# Altium schematic sheet SJA1105Q_PINOUT.SchDoc
size D; SheetNumber: 2; SheetTotal: 7
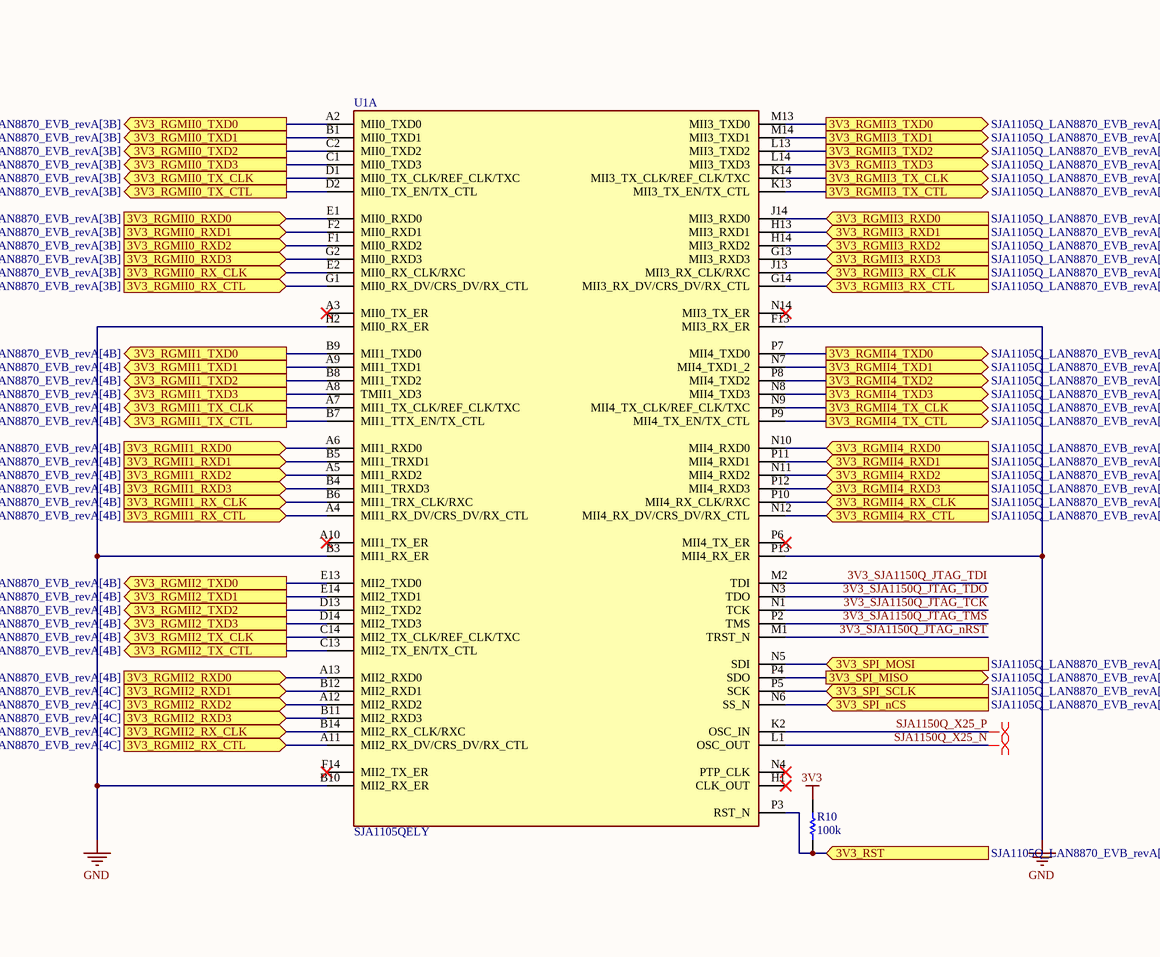
[diagram p0: SJA1105Q_PINOUT.SchDoc, top left]
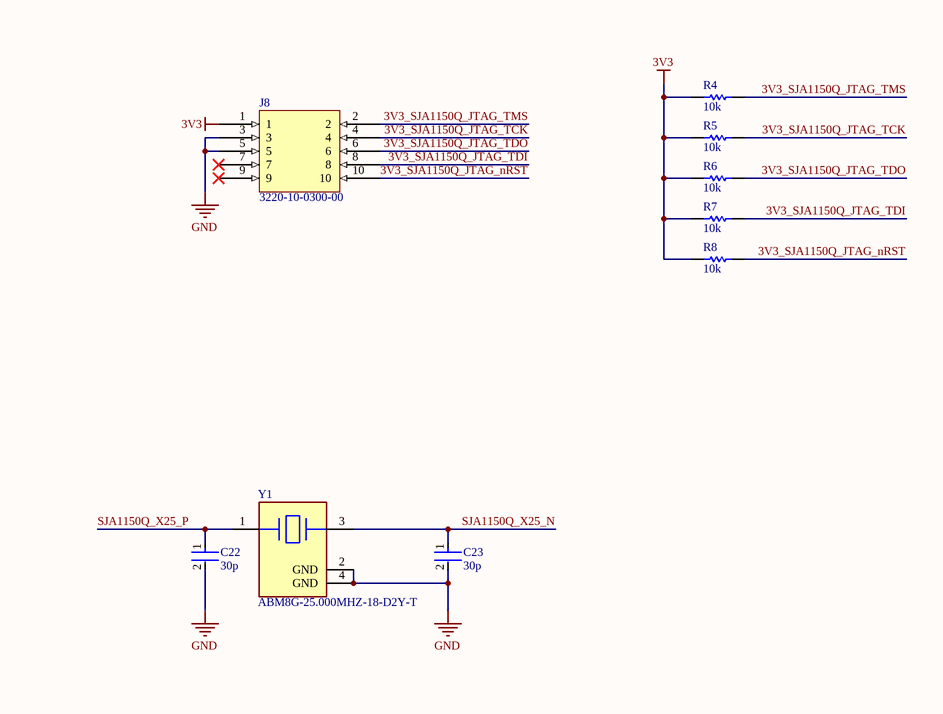
[diagram p1: SJA1105Q_PINOUT.SchDoc, top right]
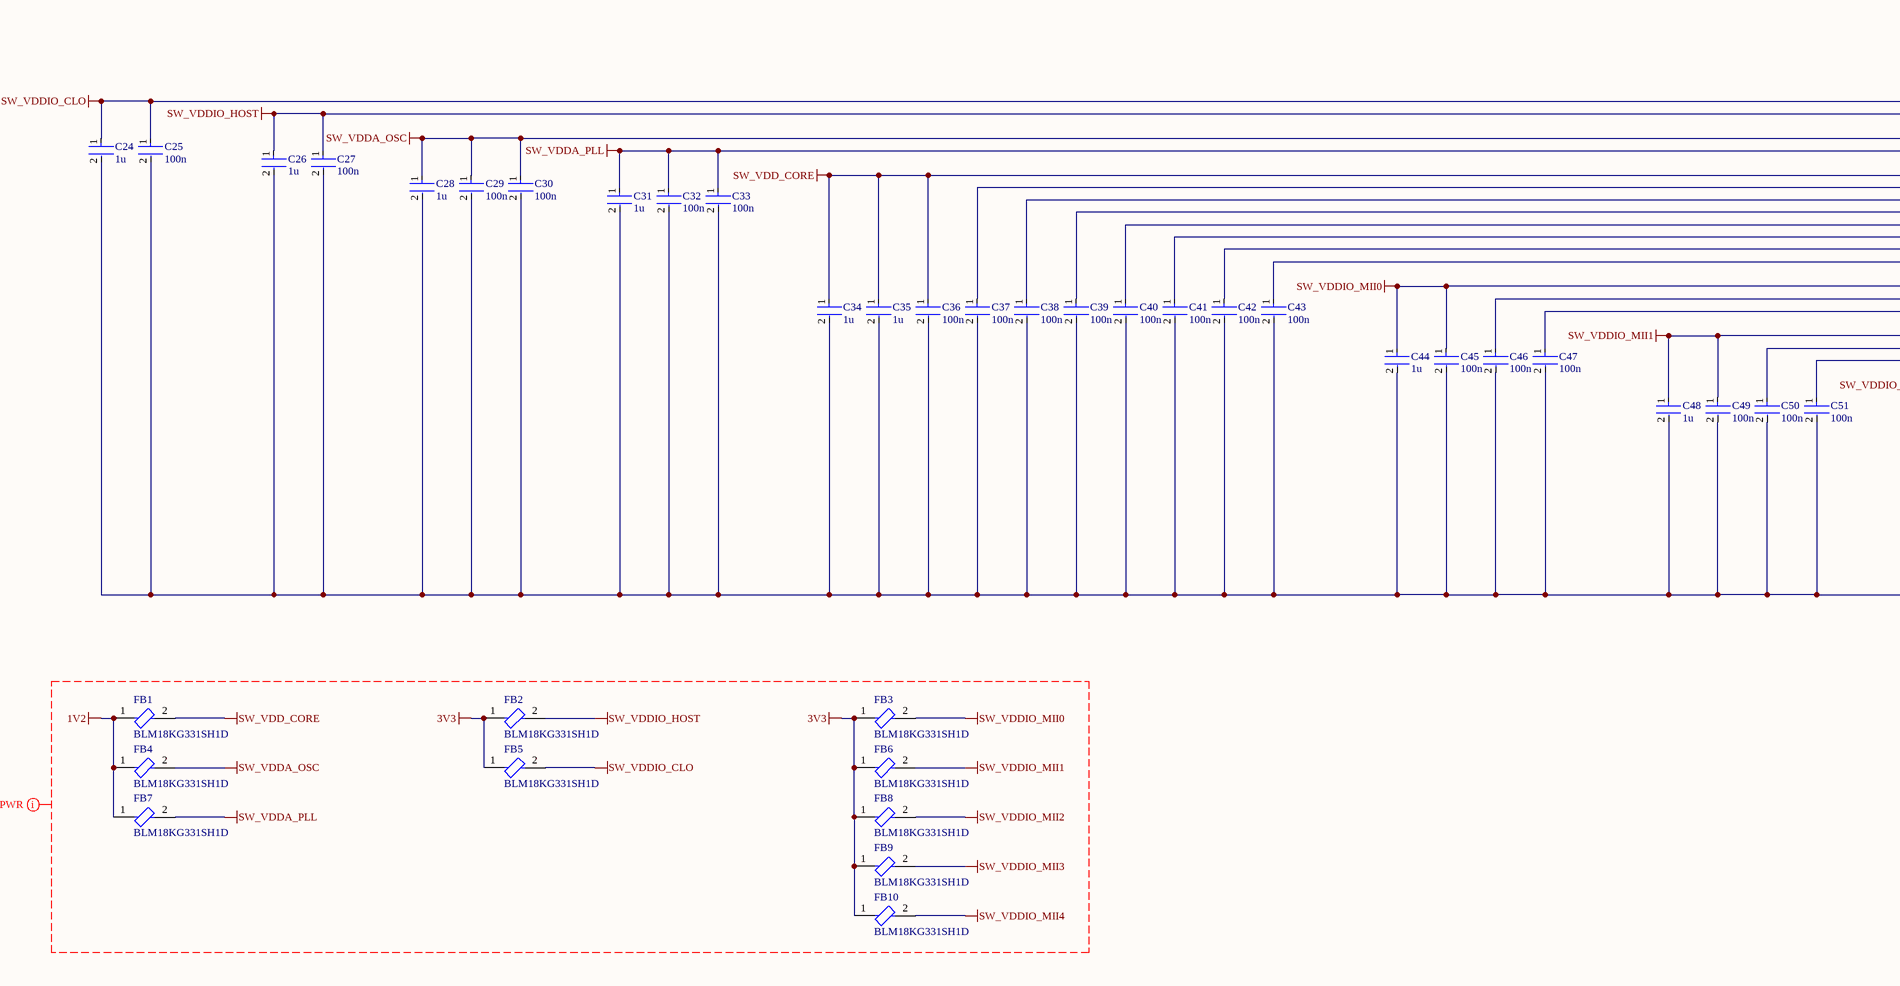
[diagram p2: SJA1105Q_PINOUT.SchDoc, bottom left]
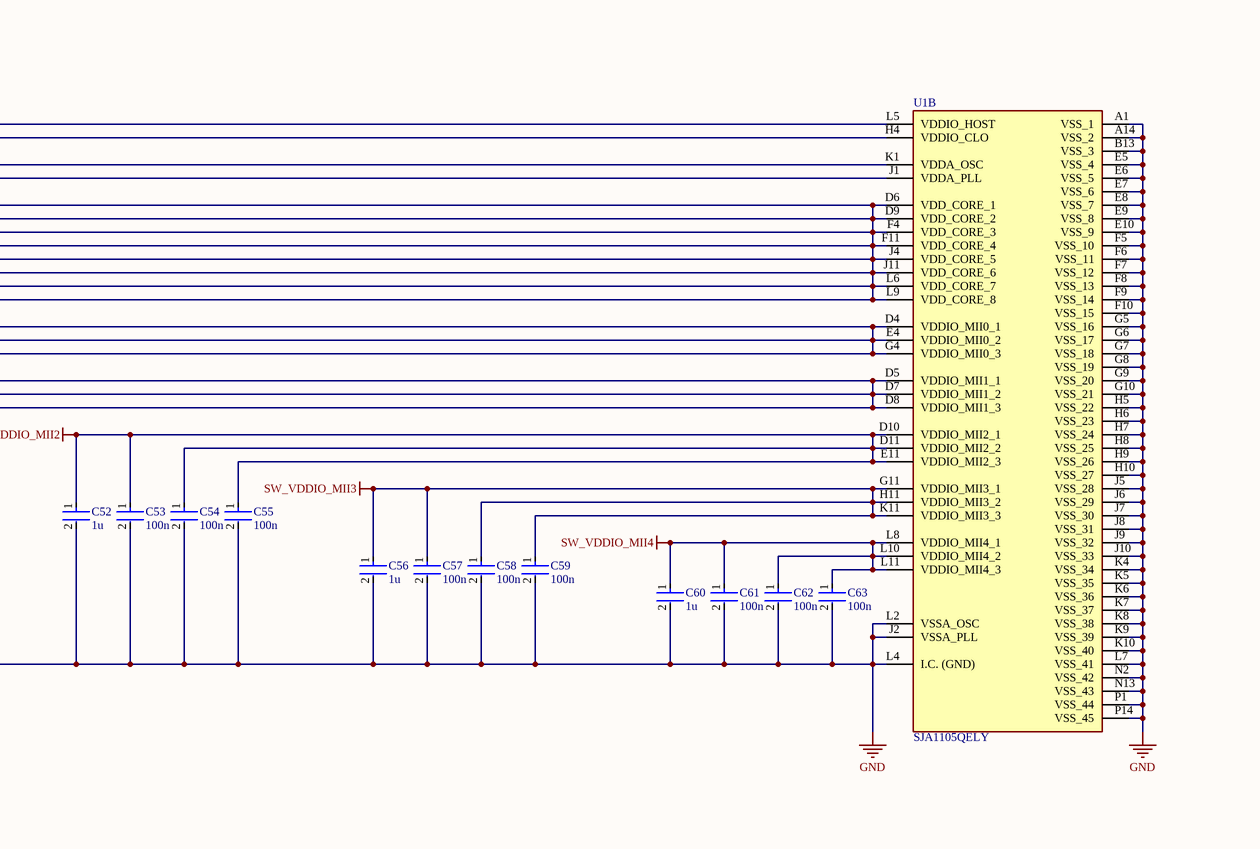
[diagram p3: SJA1105Q_PINOUT.SchDoc, bottom right]

## Parts
C22  30p  [FP-0402-L_1_0_0_05-W_0_5-IPC_A]
C23  30p  [FP-0402-L_1_0_0_05-W_0_5-IPC_A]
C24  1u  [FP-0402-L_1_0_0_05-W_0_5-IPC_A]
C25  100n  [FP-0402-L_1_0_0_05-W_0_5-IPC_A]
C26  1u  [FP-0402-L_1_0_0_05-W_0_5-IPC_A]
C27  100n  [FP-0402-L_1_0_0_05-W_0_5-IPC_A]
C28  1u  [FP-0402-L_1_0_0_05-W_0_5-IPC_A]
C29  100n  [FP-0402-L_1_0_0_05-W_0_5-IPC_A]
C30  100n  [FP-0402-L_1_0_0_05-W_0_5-IPC_A]
C31  1u  [FP-0402-L_1_0_0_05-W_0_5-IPC_A]
C32  100n  [FP-0402-L_1_0_0_05-W_0_5-IPC_A]
C33  100n  [FP-0402-L_1_0_0_05-W_0_5-IPC_A]
C34  1u  [FP-0402-L_1_0_0_05-W_0_5-IPC_A]
C35  1u  [FP-0402-L_1_0_0_05-W_0_5-IPC_A]
C36  100n  [FP-0402-L_1_0_0_05-W_0_5-IPC_A]
C37  100n  [FP-0402-L_1_0_0_05-W_0_5-IPC_A]
C38  100n  [FP-0402-L_1_0_0_05-W_0_5-IPC_A]
C39  100n  [FP-0402-L_1_0_0_05-W_0_5-IPC_A]
C40  100n  [FP-0402-L_1_0_0_05-W_0_5-IPC_A]
C41  100n  [FP-0402-L_1_0_0_05-W_0_5-IPC_A]
C42  100n  [FP-0402-L_1_0_0_05-W_0_5-IPC_A]
C43  100n  [FP-0402-L_1_0_0_05-W_0_5-IPC_A]
C44  1u  [FP-0402-L_1_0_0_05-W_0_5-IPC_A]
C45  100n  [FP-0402-L_1_0_0_05-W_0_5-IPC_A]
C46  100n  [FP-0402-L_1_0_0_05-W_0_5-IPC_A]
C47  100n  [FP-0402-L_1_0_0_05-W_0_5-IPC_A]
C48  1u  [FP-0402-L_1_0_0_05-W_0_5-IPC_A]
C49  100n  [FP-0402-L_1_0_0_05-W_0_5-IPC_A]
C50  100n  [FP-0402-L_1_0_0_05-W_0_5-IPC_A]
C51  100n  [FP-0402-L_1_0_0_05-W_0_5-IPC_A]
C52  1u  [FP-0402-L_1_0_0_05-W_0_5-IPC_A]
C53  100n  [FP-0402-L_1_0_0_05-W_0_5-IPC_A]
C54  100n  [FP-0402-L_1_0_0_05-W_0_5-IPC_A]
C55  100n  [FP-0402-L_1_0_0_05-W_0_5-IPC_A]
C56  1u  [FP-0402-L_1_0_0_05-W_0_5-IPC_A]
C57  100n  [FP-0402-L_1_0_0_05-W_0_5-IPC_A]
C58  100n  [FP-0402-L_1_0_0_05-W_0_5-IPC_A]
C59  100n  [FP-0402-L_1_0_0_05-W_0_5-IPC_A]
C60  1u  [FP-0402-L_1_0_0_05-W_0_5-IPC_A]
C61  100n  [FP-0402-L_1_0_0_05-W_0_5-IPC_A]
C62  100n  [FP-0402-L_1_0_0_05-W_0_5-IPC_A]
C63  100n  [FP-0402-L_1_0_0_05-W_0_5-IPC_A]
FB1  BLM18KG331SH1D  [FP-BLM18-0_15-t0_8-IPC_B]
FB2  BLM18KG331SH1D  [FP-BLM18-0_15-t0_8-IPC_B]
FB3  BLM18KG331SH1D  [FP-BLM18-0_15-t0_8-IPC_B]
FB4  BLM18KG331SH1D  [FP-BLM18-0_15-t0_8-IPC_B]
FB5  BLM18KG331SH1D  [FP-BLM18-0_15-t0_8-IPC_B]
FB6  BLM18KG331SH1D  [FP-BLM18-0_15-t0_8-IPC_B]
FB7  BLM18KG331SH1D  [FP-BLM18-0_15-t0_8-IPC_B]
FB8  BLM18KG331SH1D  [FP-BLM18-0_15-t0_8-IPC_B]
FB9  BLM18KG331SH1D  [FP-BLM18-0_15-t0_8-IPC_B]
FB10  BLM18KG331SH1D  [FP-BLM18-0_15-t0_8-IPC_B]
J8  3220-10-0300-00  [3220-10-0300-00-Footprint-1]
R4  10k  [R0603B]
R5  10k  [R0603B]
R6  10k  [R0603B]
R7  10k  [R0603B]
R8  10k  [R0603B]
R10  100k  [R0603B]
U1  SJA1105QELY  [SJA1105QELY-Footprint-1]  (parts A,B of 2)
Y1  ABM8G-25.000MHZ-18-D2Y-T  [FP-ABM8G-MFG]

## Ports
3V3_RGMII0_RX_CLK (in, see SJA1105Q_LAN8870_EVB_revA[3B]), 3V3_RGMII0_RX_CTL (in, see SJA1105Q_LAN8870_EVB_revA[3B]), 3V3_RGMII0_RXD0 (in, see SJA1105Q_LAN8870_EVB_revA[3B]), 3V3_RGMII0_RXD1 (in, see SJA1105Q_LAN8870_EVB_revA[3B]), 3V3_RGMII0_RXD2 (in, see SJA1105Q_LAN8870_EVB_revA[3B]), 3V3_RGMII0_RXD3 (in, see SJA1105Q_LAN8870_EVB_revA[3B]), 3V3_RGMII0_TX_CLK (out, see SJA1105Q_LAN8870_EVB_revA[3B]), 3V3_RGMII0_TX_CTL (out, see SJA1105Q_LAN8870_EVB_revA[3B]), 3V3_RGMII0_TXD0 (out, see SJA1105Q_LAN8870_EVB_revA[3B]), 3V3_RGMII0_TXD1 (out, see SJA1105Q_LAN8870_EVB_revA[3B]), 3V3_RGMII0_TXD2 (out, see SJA1105Q_LAN8870_EVB_revA[3B]), 3V3_RGMII0_TXD3 (out, see SJA1105Q_LAN8870_EVB_revA[3B]), 3V3_RGMII1_RX_CLK (in, see SJA1105Q_LAN8870_EVB_revA[4B]), 3V3_RGMII1_RX_CTL (in, see SJA1105Q_LAN8870_EVB_revA[4B]), 3V3_RGMII1_RXD0 (in, see SJA1105Q_LAN8870_EVB_revA[4B]), 3V3_RGMII1_RXD1 (in, see SJA1105Q_LAN8870_EVB_revA[4B]), 3V3_RGMII1_RXD2 (in, see SJA1105Q_LAN8870_EVB_revA[4B]), 3V3_RGMII1_RXD3 (in, see SJA1105Q_LAN8870_EVB_revA[4B]), 3V3_RGMII1_TX_CLK (out, see SJA1105Q_LAN8870_EVB_revA[4B]), 3V3_RGMII1_TX_CTL (out, see SJA1105Q_LAN8870_EVB_revA[4B]), 3V3_RGMII1_TXD0 (out, see SJA1105Q_LAN8870_EVB_revA[4B]), 3V3_RGMII1_TXD1 (out, see SJA1105Q_LAN8870_EVB_revA[4B]), 3V3_RGMII1_TXD2 (out, see SJA1105Q_LAN8870_EVB_revA[4B]), 3V3_RGMII1_TXD3 (out, see SJA1105Q_LAN8870_EVB_revA[4B]), 3V3_RGMII2_RX_CLK (in, see SJA1105Q_LAN8870_EVB_revA[4C]), 3V3_RGMII2_RX_CTL (in, see SJA1105Q_LAN8870_EVB_revA[4C]), 3V3_RGMII2_RXD0 (in, see SJA1105Q_LAN8870_EVB_revA[4B]), 3V3_RGMII2_RXD1 (in, see SJA1105Q_LAN8870_EVB_revA[4C]), 3V3_RGMII2_RXD2 (in, see SJA1105Q_LAN8870_EVB_revA[4C]), 3V3_RGMII2_RXD3 (in, see SJA1105Q_LAN8870_EVB_revA[4C]), 3V3_RGMII2_TX_CLK (out, see SJA1105Q_LAN8870_EVB_revA[4B]), 3V3_RGMII2_TX_CTL (out, see SJA1105Q_LAN8870_EVB_revA[4B]), 3V3_RGMII2_TXD0 (out, see SJA1105Q_LAN8870_EVB_revA[4B]), 3V3_RGMII2_TXD1 (out, see SJA1105Q_LAN8870_EVB_revA[4B]), 3V3_RGMII2_TXD2 (out, see SJA1105Q_LAN8870_EVB_revA[4B]), 3V3_RGMII2_TXD3 (out, see SJA1105Q_LAN8870_EVB_revA[4B]), 3V3_RGMII3_RX_CLK (in, see SJA1105Q_LAN8870_EVB_revA[4C]), 3V3_RGMII3_RX_CTL (in, see SJA1105Q_LAN8870_EVB_revA[4C]), 3V3_RGMII3_RXD0 (in, see SJA1105Q_LAN8870_EVB_revA[4C]), 3V3_RGMII3_RXD1 (in, see SJA1105Q_LAN8870_EVB_revA[4C]), 3V3_RGMII3_RXD2 (in, see SJA1105Q_LAN8870_EVB_revA[4C]), 3V3_RGMII3_RXD3 (in, see SJA1105Q_LAN8870_EVB_revA[4C]), 3V3_RGMII3_TX_CLK (out, see SJA1105Q_LAN8870_EVB_revA[4C]), 3V3_RGMII3_TX_CTL (out, see SJA1105Q_LAN8870_EVB_revA[4C]), 3V3_RGMII3_TXD0 (out, see SJA1105Q_LAN8870_EVB_revA[4C]), 3V3_RGMII3_TXD1 (out, see SJA1105Q_LAN8870_EVB_revA[4C]), 3V3_RGMII3_TXD2 (out, see SJA1105Q_LAN8870_EVB_revA[4C]), 3V3_RGMII3_TXD3 (out, see SJA1105Q_LAN8870_EVB_revA[4C]), 3V3_RGMII4_RX_CLK (in, see SJA1105Q_LAN8870_EVB_revA[4C]), 3V3_RGMII4_RX_CTL (in, see SJA1105Q_LAN8870_EVB_revA[4C]), 3V3_RGMII4_RXD0 (in, see SJA1105Q_LAN8870_EVB_revA[4C]), 3V3_RGMII4_RXD1 (in, see SJA1105Q_LAN8870_EVB_revA[4C]), 3V3_RGMII4_RXD2 (in, see SJA1105Q_LAN8870_EVB_revA[4C]), 3V3_RGMII4_RXD3 (in, see SJA1105Q_LAN8870_EVB_revA[4C]), 3V3_RGMII4_TX_CLK (out, see SJA1105Q_LAN8870_EVB_revA[4C]), 3V3_RGMII4_TX_CTL (out, see SJA1105Q_LAN8870_EVB_revA[4C]), 3V3_RGMII4_TXD0 (out, see SJA1105Q_LAN8870_EVB_revA[4C]), 3V3_RGMII4_TXD1 (out, see SJA1105Q_LAN8870_EVB_revA[4C]), 3V3_RGMII4_TXD2 (out, see SJA1105Q_LAN8870_EVB_revA[4C]), 3V3_RGMII4_TXD3 (out, see SJA1105Q_LAN8870_EVB_revA[4C]), 3V3_RST (in, see SJA1105Q_LAN8870_EVB_revA[3C]), 3V3_SPI_MISO (out, see SJA1105Q_LAN8870_EVB_revA[3C]), 3V3_SPI_MOSI (in, see SJA1105Q_LAN8870_EVB_revA[3C]), 3V3_SPI_nCS (in, see SJA1105Q_LAN8870_EVB_revA[3C]), 3V3_SPI_SCLK (in, see SJA1105Q_LAN8870_EVB_revA[3C])

## Nets
1V2: FB1.1 FB4.1 FB7.1
3V3: FB2.1 FB3.1 FB5.1 FB6.1 FB8.1 FB9.1 FB10.1 J8.1 R4.1 R5.1 R6.1 R7.2 R8.1 R10.2
GND: C22.2 C23.2 C24.2 C25.2 C26.2 C27.2 C28.2 C29.2 C30.2 C31.2 C32.2 C33.2 C34.2 C35.2 C36.2 C37.2 C38.2 C39.2 C40.2 C41.2 C42.2 C43.2 C44.2 C45.2 C46.2 C47.2 C48.2 C49.2 C50.2 C51.2 C52.2 C53.2 C54.2 C55.2 C56.2 C57.2 C58.2 C59.2 C60.2 C61.2 C62.2 C63.2 J8.3 J8.5 U1.A1(VSS_1) U1.A14(VSS_2) U1.B3(MII1_RX_ER) U1.B10(MII2_RX_ER) U1.B13(VSS_3) U1.E5(VSS_4) U1.E6(VSS_5) U1.E7(VSS_6) U1.E8(VSS_7) U1.E9(VSS_8) U1.E10(VSS_9) U1.F5(VSS_10) U1.F6(VSS_11) U1.F7(VSS_12) U1.F8(VSS_13) U1.F9(VSS_14) U1.F10(VSS_15) U1.F13(MII3_RX_ER) U1.G5(VSS_16) U1.G6(VSS_17) U1.G7(VSS_18) U1.G8(VSS_19) U1.G9(VSS_20) U1.G10(VSS_21) U1.H2(MII0_RX_ER) U1.H5(VSS_22) U1.H6(VSS_23) U1.H7(VSS_24) U1.H8(VSS_25) U1.H9(VSS_26) U1.H10(VSS_27) U1.J2(VSSA_PLL) U1.J5(VSS_28) U1.J6(VSS_29) U1.J7(VSS_30) U1.J8(VSS_31) U1.J9(VSS_32) U1.J10(VSS_33) U1.K4(VSS_34) U1.K5(VSS_35) U1.K6(VSS_36) U1.K7(VSS_37) U1.K8(VSS_38) U1.K9(VSS_39) U1.K10(VSS_40) U1.L2(VSSA_OSC) U1.L4(I.C._(GND)) U1.L7(VSS_41) U1.N2(VSS_42) U1.N13(VSS_43) U1.P1(VSS_44) U1.P13(MII4_RX_ER) U1.P14(VSS_45) Y1.2(GND) Y1.4(GND)
SW_VDD_CORE: C34.1 C35.1 C36.1 C37.1 C38.1 C39.1 C40.1 C41.1 C42.1 C43.1 FB1.2 U1.D6(VDD_CORE_1) U1.D9(VDD_CORE_2) U1.F4(VDD_CORE_3) U1.F11(VDD_CORE_4) U1.J4(VDD_CORE_5) U1.J11(VDD_CORE_6) U1.L6(VDD_CORE_7) U1.L9(VDD_CORE_8)
SW_VDDA_OSC: C28.1 C29.1 C30.1 FB4.2 U1.K1(VDDA_OSC)
SW_VDDA_PLL: C31.1 C32.1 C33.1 FB7.2 U1.J1(VDDA_PLL)
SW_VDDIO_CLO: C24.1 C25.1 FB5.2 U1.L5(VDDIO_HOST)
SW_VDDIO_HOST: C26.1 C27.1 FB2.2 U1.H4(VDDIO_CLO)
SW_VDDIO_MII0: C44.1 C45.1 C46.1 C47.1 FB3.2 U1.D4(VDDIO_MII0_1) U1.E4(VDDIO_MII0_2) U1.G4(VDDIO_MII0_3)
SW_VDDIO_MII1: C48.1 C49.1 C50.1 C51.1 FB6.2 U1.D5(VDDIO_MII1_1) U1.D7(VDDIO_MII1_2) U1.D8(VDDIO_MII1_3)
SW_VDDIO_MII2: C52.1 C53.1 C54.1 C55.1 FB8.2 U1.D10(VDDIO_MII2_1) U1.D11(VDDIO_MII2_2) U1.E11(VDDIO_MII2_3)
SW_VDDIO_MII3: C56.1 C57.1 C58.1 C59.1 FB9.2 U1.G11(VDDIO_MII3_1) U1.H11(VDDIO_MII3_2) U1.K11(VDDIO_MII3_3)
SW_VDDIO_MII4: C60.1 C61.1 C62.1 C63.1 FB10.2 U1.L8(VDDIO_MII4_1) U1.L10(VDDIO_MII4_2) U1.L11(VDDIO_MII4_3)
3V3_RGMII0_RX_CLK: U1.E2(MII0_RX_CLK/RXC) ; port 3V3_RGMII0_RX_CLK
3V3_RGMII0_RX_CTL: U1.G1(MII0_RX_DV/CRS_DV/RX_CTL) ; port 3V3_RGMII0_RX_CTL
3V3_RGMII0_RXD0: U1.E1(MII0_RXD0) ; port 3V3_RGMII0_RXD0
3V3_RGMII0_RXD1: U1.F2(MII0_RXD1) ; port 3V3_RGMII0_RXD1
3V3_RGMII0_RXD2: U1.F1(MII0_RXD2) ; port 3V3_RGMII0_RXD2
3V3_RGMII0_RXD3: U1.G2(MII0_RXD3) ; port 3V3_RGMII0_RXD3
3V3_RGMII0_TX_CLK: U1.D1(MII0_TX_CLK/REF_CLK/TXC) ; port 3V3_RGMII0_TX_CLK
3V3_RGMII0_TX_CTL: U1.D2(MII0_TX_EN/TX_CTL) ; port 3V3_RGMII0_TX_CTL
3V3_RGMII0_TXD0: U1.A2(MII0_TXD0) ; port 3V3_RGMII0_TXD0
3V3_RGMII0_TXD1: U1.B1(MII0_TXD1) ; port 3V3_RGMII0_TXD1
3V3_RGMII0_TXD2: U1.C2(MII0_TXD2) ; port 3V3_RGMII0_TXD2
3V3_RGMII0_TXD3: U1.C1(MII0_TXD3) ; port 3V3_RGMII0_TXD3
3V3_RGMII1_RX_CLK: U1.B6(MII1_TRX_CLK/RXC) ; port 3V3_RGMII1_RX_CLK
3V3_RGMII1_RX_CTL: U1.A4(MII1_RX_DV/CRS_DV/RX_CTL) ; port 3V3_RGMII1_RX_CTL
3V3_RGMII1_RXD0: U1.A6(MII1_RXD0) ; port 3V3_RGMII1_RXD0
3V3_RGMII1_RXD1: U1.B5(MII1_TRXD1) ; port 3V3_RGMII1_RXD1
3V3_RGMII1_RXD2: U1.A5(MII1_RXD2) ; port 3V3_RGMII1_RXD2
3V3_RGMII1_RXD3: U1.B4(MII1_TRXD3) ; port 3V3_RGMII1_RXD3
3V3_RGMII1_TX_CLK: U1.A7(MII1_TX_CLK/REF_CLK/TXC) ; port 3V3_RGMII1_TX_CLK
3V3_RGMII1_TX_CTL: U1.B7(MII1_TTX_EN/TX_CTL) ; port 3V3_RGMII1_TX_CTL
3V3_RGMII1_TXD0: U1.B9(MII1_TXD0) ; port 3V3_RGMII1_TXD0
3V3_RGMII1_TXD1: U1.A9(MII1_TXD1) ; port 3V3_RGMII1_TXD1
3V3_RGMII1_TXD2: U1.B8(MII1_TXD2) ; port 3V3_RGMII1_TXD2
3V3_RGMII1_TXD3: U1.A8(TMII1_XD3) ; port 3V3_RGMII1_TXD3
3V3_RGMII2_RX_CLK: U1.B14(MII2_RX_CLK/RXC) ; port 3V3_RGMII2_RX_CLK
3V3_RGMII2_RX_CTL: U1.A11(MII2_RX_DV/CRS_DV/RX_CTL) ; port 3V3_RGMII2_RX_CTL
3V3_RGMII2_RXD0: U1.A13(MII2_RXD0) ; port 3V3_RGMII2_RXD0
3V3_RGMII2_RXD1: U1.B12(MII2_RXD1) ; port 3V3_RGMII2_RXD1
3V3_RGMII2_RXD2: U1.A12(MII2_RXD2) ; port 3V3_RGMII2_RXD2
3V3_RGMII2_RXD3: U1.B11(MII2_RXD3) ; port 3V3_RGMII2_RXD3
3V3_RGMII2_TX_CLK: U1.C14(MII2_TX_CLK/REF_CLK/TXC) ; port 3V3_RGMII2_TX_CLK
3V3_RGMII2_TX_CTL: U1.C13(MII2_TX_EN/TX_CTL) ; port 3V3_RGMII2_TX_CTL
3V3_RGMII2_TXD0: U1.E13(MII2_TXD0) ; port 3V3_RGMII2_TXD0
3V3_RGMII2_TXD1: U1.E14(MII2_TXD1) ; port 3V3_RGMII2_TXD1
3V3_RGMII2_TXD2: U1.D13(MII2_TXD2) ; port 3V3_RGMII2_TXD2
3V3_RGMII2_TXD3: U1.D14(MII2_TXD3) ; port 3V3_RGMII2_TXD3
3V3_RGMII3_RX_CLK: U1.J13(MII3_RX_CLK/RXC) ; port 3V3_RGMII3_RX_CLK
3V3_RGMII3_RX_CTL: U1.G14(MII3_RX_DV/CRS_DV/RX_CTL) ; port 3V3_RGMII3_RX_CTL
3V3_RGMII3_RXD0: U1.J14(MII3_RXD0) ; port 3V3_RGMII3_RXD0
3V3_RGMII3_RXD1: U1.H13(MII3_RXD1) ; port 3V3_RGMII3_RXD1
3V3_RGMII3_RXD2: U1.H14(MII3_RXD2) ; port 3V3_RGMII3_RXD2
3V3_RGMII3_RXD3: U1.G13(MII3_RXD3) ; port 3V3_RGMII3_RXD3
3V3_RGMII3_TX_CLK: U1.K14(MII3_TX_CLK/REF_CLK/TXC) ; port 3V3_RGMII3_TX_CLK
3V3_RGMII3_TX_CTL: U1.K13(MII3_TX_EN/TX_CTL) ; port 3V3_RGMII3_TX_CTL
3V3_RGMII3_TXD0: U1.M13(MII3_TXD0) ; port 3V3_RGMII3_TXD0
3V3_RGMII3_TXD1: U1.M14(MII3_TXD1) ; port 3V3_RGMII3_TXD1
3V3_RGMII3_TXD2: U1.L13(MII3_TXD2) ; port 3V3_RGMII3_TXD2
3V3_RGMII3_TXD3: U1.L14(MII3_TXD3) ; port 3V3_RGMII3_TXD3
3V3_RGMII4_RX_CLK: U1.P10(MII4_RX_CLK/RXC) ; port 3V3_RGMII4_RX_CLK
3V3_RGMII4_RX_CTL: U1.N12(MII4_RX_DV/CRS_DV/RX_CTL) ; port 3V3_RGMII4_RX_CTL
3V3_RGMII4_RXD0: U1.N10(MII4_RXD0) ; port 3V3_RGMII4_RXD0
3V3_RGMII4_RXD1: U1.P11(MII4_RXD1) ; port 3V3_RGMII4_RXD1
3V3_RGMII4_RXD2: U1.N11(MII4_RXD2) ; port 3V3_RGMII4_RXD2
3V3_RGMII4_RXD3: U1.P12(MII4_RXD3) ; port 3V3_RGMII4_RXD3
3V3_RGMII4_TX_CLK: U1.N9(MII4_TX_CLK/REF_CLK/TXC) ; port 3V3_RGMII4_TX_CLK
3V3_RGMII4_TX_CTL: U1.P9(MII4_TX_EN/TX_CTL) ; port 3V3_RGMII4_TX_CTL
3V3_RGMII4_TXD0: U1.P7(MII4_TXD0) ; port 3V3_RGMII4_TXD0
3V3_RGMII4_TXD1: U1.N7(MII4_TXD1_2) ; port 3V3_RGMII4_TXD1
3V3_RGMII4_TXD2: U1.P8(MII4_TXD2) ; port 3V3_RGMII4_TXD2
3V3_RGMII4_TXD3: U1.N8(MII4_TXD3) ; port 3V3_RGMII4_TXD3
3V3_RST: R10.1 U1.P3(RST_N) ; port 3V3_RST
3V3_SJA1150Q_JTAG_nRST: J8.10 R8.2 U1.M1(TRST_N)
3V3_SJA1150Q_JTAG_TCK: J8.4 R5.2 U1.N1(TCK)
3V3_SJA1150Q_JTAG_TDI: J8.8 R7.1 U1.M2(TDI)
3V3_SJA1150Q_JTAG_TDO: J8.6 R6.2 U1.N3(TDO)
3V3_SJA1150Q_JTAG_TMS: J8.2 R4.2 U1.P2(TMS)
3V3_SPI_MISO: U1.P4(SDO) ; port 3V3_SPI_MISO
3V3_SPI_MOSI: U1.N5(SDI) ; port 3V3_SPI_MOSI
3V3_SPI_nCS: U1.N6(SS_N) ; port 3V3_SPI_nCS
3V3_SPI_SCLK: U1.P5(SCK) ; port 3V3_SPI_SCLK
SJA1150Q_X25_N: C23.1 U1.L1(OSC_OUT) Y1.3
SJA1150Q_X25_P: C22.1 U1.K2(OSC_IN) Y1.1

Not connected (* = marked no-connect by the designer): J8 7* 9*; U1 A3(MII0_TX_ER)* A10(MII1_TX_ER)* F14(MII2_TX_ER)* H1(CLK_OUT)* N4(PTP_CLK)* N14(MII3_TX_ER)* P6(MII4_TX_ER)*

## Layout directives
differential pair: SJA1150Q_X25_N, SJA1150Q_X25_P
net class PWR: 1V2, 3V3, SW_VDD_CORE, SW_VDDA_OSC, SW_VDDA_PLL, SW_VDDIO_CLO, SW_VDDIO_HOST, SW_VDDIO_MII0, SW_VDDIO_MII1, SW_VDDIO_MII2, SW_VDDIO_MII3, SW_VDDIO_MII4

## Library data of the parts
C22-C63 = CMP-001-00058-1: LARGE PADS, 0402 CAP, CHANGE COMMENT TO MATCH REAL P/N; Capacitor Type: Ceramic; Min Operating Temperature: -55°C; Mounting Technology: Surface Mount; Pins: 2; Case/Package: 0402; RoHS Compliant: Yes; Max Operating Temperature: 85°C
FB1-FB10 = CMP-06046-002069-1: Chip Ferrite Bead, 0603, 330Ω @ 100MHz, 0.08Ω, 25%, 1.7A; Number of Lines: 1; DC Resistance (DCR): 80mR; Packaging: Tape and Reel; Case/Package: 0603; Height: 0.037inch; Case Code (Metric): 1608; Length: 0.063inch; Package Quantity: 4000; Max Operating Temperature: 125°C; Case Code (Imperial): 0603; RoHS Compliant: Yes; Width: 0.032inch; Mount: Surface Mount; Min Operating Temperature: -55°C; Ratings: AEC-Q200; Max Current Rating: 1.7A
J8 = CMP-001-0013-3: CONN HEADER SMD 10POS 1.27MM
R4-R8 R10 = CMP-009-00002-14: Resistor
  R4-R8: Value: 10k
  R10: Value: 100k
U1 = CMP-015-00025-2: Ethernet Controller, Ethernet Switch, IEEE 802.3, 1.2 V, LFBGA, 159 Pins; Min Operating Temperature: -40°C; Max Operating Temperature: 105°C
Y1 = CMP-2000-05733-3: Crystal 25MHz ±20ppm (Tol) ±30ppm (Stability) 18pF FUND 60Ω 4-Pin SMD T/R; Series Resistance: 60R; Length: 3.2mm; Depth: 2.5mm; Packaging: Tape and Reel; Min Operating Temperature: -40°C; Operating Frequency: 25 MHz; Lead Free: Lead Free; Number of Pins: 4; Frequency Tolerance: 20ppm; Radiation Hardening: No; Max Operating Temperature: 85°C; Termination: SMD/SMT; Frequency Stability: 30ppm; Frequency: 25MHz; Series: ABM8G; Mount: Surface Mount; Package Quantity: 1000; Height: 0.039inch; Width: 0.098inch; Case/Package: CSMD; ESR (Equivalent Series Resistance): 60R; Load Capacitance: 18pF; Tolerance: 20ppm